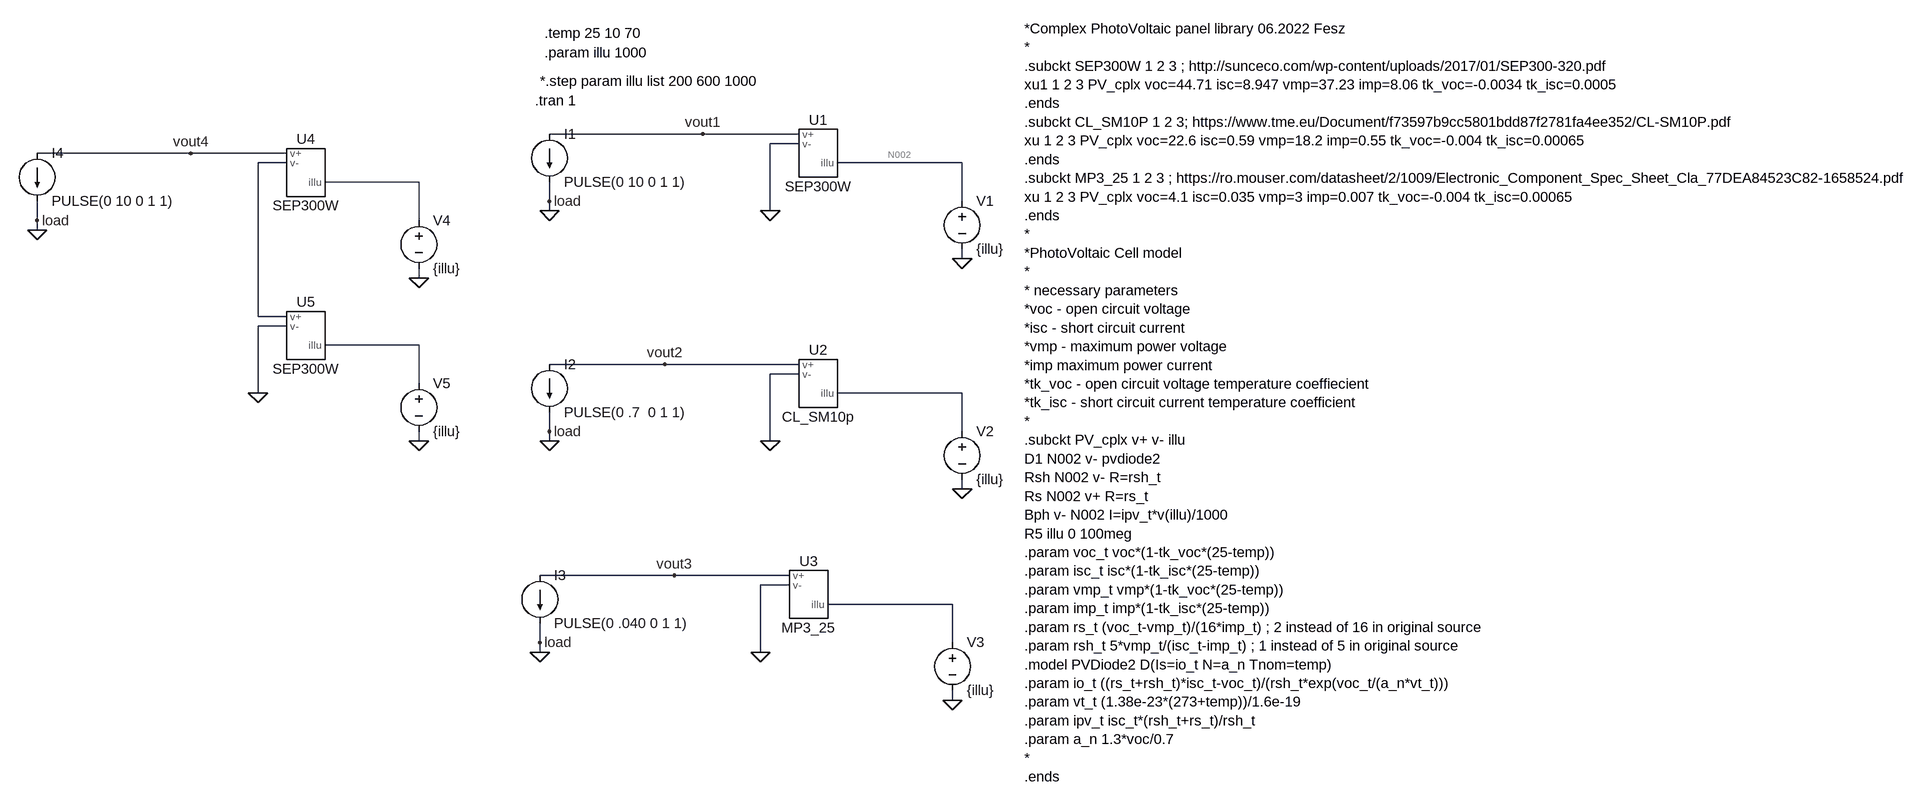
[diagram p0: schematic sch2_with_cells.asc]
sch2_with_cells.asc, the LTspice schematic file:
Version 4
SHEET 1 2124 1312
WIRE -848 256 -1104 256
WIRE -688 256 -848 256
WIRE -688 272 -736 272
WIRE -1872 288 -2128 288
WIRE -1712 288 -1872 288
WIRE -1712 304 -1760 304
WIRE -416 304 -624 304
WIRE -1440 336 -1648 336
WIRE -1104 368 -1104 336
WIRE -416 368 -416 304
WIRE -1104 384 -1104 368
WIRE -736 384 -736 272
WIRE -2128 400 -2128 368
WIRE -1440 400 -1440 336
WIRE -2128 416 -2128 400
WIRE -416 464 -416 448
WIRE -1440 496 -1440 480
WIRE -1760 560 -1760 304
WIRE -1712 560 -1760 560
WIRE -1712 576 -1760 576
WIRE -1440 608 -1648 608
WIRE -912 640 -1104 640
WIRE -688 640 -912 640
WIRE -688 656 -736 656
WIRE -1440 672 -1440 608
WIRE -1760 688 -1760 576
WIRE -416 688 -624 688
WIRE -1104 752 -1104 720
WIRE -416 752 -416 688
WIRE -1440 768 -1440 752
WIRE -1104 768 -1104 752
WIRE -736 768 -736 656
WIRE -416 848 -416 832
WIRE -896 992 -1120 992
WIRE -704 992 -896 992
WIRE -704 1008 -752 1008
WIRE -432 1040 -640 1040
WIRE -1120 1104 -1120 1072
WIRE -432 1104 -432 1040
WIRE -1120 1120 -1120 1104
WIRE -752 1120 -752 1008
WIRE -432 1200 -432 1184
FLAG -1104 384 0
FLAG -736 384 0
FLAG -416 464 0
FLAG -1104 368 load
FLAG -1104 768 0
FLAG -736 768 0
FLAG -416 848 0
FLAG -1104 752 load
FLAG -1120 1120 0
FLAG -752 1120 0
FLAG -432 1200 0
FLAG -1120 1104 load
FLAG -848 256 vout1
FLAG -912 640 vout2
FLAG -896 992 vout3
FLAG -2128 416 0
FLAG -1440 496 0
FLAG -2128 400 load
FLAG -1872 288 vout4
FLAG -1440 768 0
FLAG -1760 688 0
SYMBOL testcell1 -656 288 R0
SYMATTR InstName U1
SYMATTR Value SEP300W
SYMBOL current -1104 256 R0
WINDOW 123 0 0 Left 0
WINDOW 39 0 0 Left 0
SYMATTR InstName I1
SYMATTR Value PULSE(0 10 0 1 1)
SYMBOL voltage -416 352 R0
SYMATTR InstName V1
SYMATTR Value {illu}
SYMBOL testcell1 -656 672 R0
SYMATTR InstName U2
SYMATTR Value CL_SM10p
SYMBOL current -1104 640 R0
WINDOW 123 0 0 Left 0
WINDOW 39 0 0 Left 0
SYMATTR InstName I2
SYMATTR Value PULSE(0 .7  0 1 1)
SYMBOL voltage -416 736 R0
SYMATTR InstName V2
SYMATTR Value {illu}
SYMBOL testcell1 -672 1024 R0
SYMATTR InstName U3
SYMATTR Value MP3_25
SYMBOL current -1120 992 R0
WINDOW 123 0 0 Left 0
WINDOW 39 0 0 Left 0
SYMATTR InstName I3
SYMATTR Value PULSE(0 .040 0 1 1)
SYMBOL voltage -432 1088 R0
SYMATTR InstName V3
SYMATTR Value {illu}
SYMBOL testcell1 -1680 320 R0
SYMATTR InstName U4
SYMATTR Value SEP300W
SYMBOL current -2128 288 R0
WINDOW 123 0 0 Left 0
WINDOW 39 0 0 Left 0
SYMATTR InstName I4
SYMATTR Value PULSE(0 10 0 1 1)
SYMBOL voltage -1440 384 R0
SYMATTR InstName V4
SYMATTR Value {illu}
SYMBOL testcell1 -1680 592 R0
SYMATTR InstName U5
SYMATTR Value SEP300W
SYMBOL voltage -1440 656 R0
SYMATTR InstName V5
SYMATTR Value {illu}
TEXT -312 80 Left 2 !*Complex PhotoVoltaic panel library 06.2022 Fesz\n*\n.subckt SEP300W 1 2 3 ; http://sunceco.com/wp-content/uploads/2017/01/SEP300-320.pdf\nxu1 1 2 3 PV_cplx voc=44.71 isc=8.947 vmp=37.23 imp=8.06 tk_voc=-0.0034 tk_isc=0.0005\n.ends\n.subckt CL_SM10P 1 2 3; https://www.tme.eu/Document/f73597b9cc5801bdd87f2781fa4ee352/CL-SM10P.pdf\nxu 1 2 3 PV_cplx voc=22.6 isc=0.59 vmp=18.2 imp=0.55 tk_voc=-0.004 tk_isc=0.00065\n.ends\n.subckt MP3_25 1 2 3 ; https://ro.mouser.com/datasheet/2/1009/Electronic_Component_Spec_Sheet_Cla_77DEA84523C82-1658524.pdf\nxu 1 2 3 PV_cplx voc=4.1 isc=0.035 vmp=3 imp=0.007 tk_voc=-0.004 tk_isc=0.00065\n.ends\n*\n*PhotoVoltaic Cell model\n*\n* necessary parameters\n*voc - open circuit voltage\n*isc - short circuit current\n*vmp - maximum power voltage\n*imp maximum power current\n*tk_voc - open circuit voltage temperature coeffiecient\n*tk_isc - short circuit current temperature coefficient\n*\n.subckt PV_cplx v+ v- illu \nD1 N002 v- pvdiode2\nRsh N002 v- R=rsh_t\nRs N002 v+ R=rs_t\nBph v- N002 I=ipv_t*v(illu)/1000\nR5 illu 0 100meg\n.param voc_t voc*(1-tk_voc*(25-temp))\n.param isc_t isc*(1-tk_isc*(25-temp))\n.param vmp_t vmp*(1-tk_voc*(25-temp))\n.param imp_t imp*(1-tk_isc*(25-temp))\n.param rs_t (voc_t-vmp_t)/(16*imp_t) ; 2 instead of 16 in original source\n.param rsh_t 5*vmp_t/(isc_t-imp_t) ; 1 instead of 5 in original source\n.model PVDiode2 D(Is=io_t N=a_n Tnom=temp)\n.param io_t ((rs_t+rsh_t)*isc_t-voc_t)/(rsh_t*exp(voc_t/(a_n*vt_t)))\n.param vt_t (1.38e-23*(273+temp))/1.6e-19\n.param ipv_t isc_t*(rsh_t+rs_t)/rsh_t\n.param a_n 1.3*voc/0.7\n*\n.ends
TEXT -1112 88 Left 2 !.temp 25 10 70
TEXT -1112 120 Left 2 !.param illu 1000
TEXT -1120 168 Left 2 !*.step param illu list 200 600 1000
TEXT -1128 200 Left 2 !.tran 1

The netlist it stands for:
* sch2_with_cells.asc
XU1 vout1 0 N002 SEP300W  ; pins v+ v- illu
I1 vout1 0 PULSE(0 10 0 1 1)
V1 N002 0 {illu}
XU2 vout2 0 N005 CL_SM10p  ; pins v+ v- illu
I2 vout2 0 PULSE(0 .7  0 1 1)
V2 N005 0 {illu}
XU3 vout3 0 N006 MP3_25  ; pins v+ v- illu
I3 vout3 0 PULSE(0 .040 0 1 1)
V3 N006 0 {illu}
XU4 vout4 N001 N003 SEP300W  ; pins v+ v- illu
I4 vout4 0 PULSE(0 10 0 1 1)
V4 N003 0 {illu}
XU5 N001 0 N004 SEP300W  ; pins v+ v- illu
V5 N004 0 {illu}
*Complex PhotoVoltaic panel library 06.2022 Fesz
*
.subckt SEP300W 1 2 3 ; http://sunceco.com/wp-content/uploads/2017/01/SEP300-320.pdf
xu1 1 2 3 PV_cplx voc=44.71 isc=8.947 vmp=37.23 imp=8.06 tk_voc=-0.0034 tk_isc=0.0005
.ends
.subckt CL_SM10P 1 2 3; https://www.tme.eu/Document/f73597b9cc5801bdd87f2781fa4ee352/CL-SM10P.pdf
xu 1 2 3 PV_cplx voc=22.6 isc=0.59 vmp=18.2 imp=0.55 tk_voc=-0.004 tk_isc=0.00065
.ends
.subckt MP3_25 1 2 3 ; https://ro.mouser.com/datasheet/2/1009/Electronic_Component_Spec_Sheet_Cla_77DEA84523C82-1658524.pdf
xu 1 2 3 PV_cplx voc=4.1 isc=0.035 vmp=3 imp=0.007 tk_voc=-0.004 tk_isc=0.00065
.ends
*
*PhotoVoltaic Cell model
*
* necessary parameters
*voc - open circuit voltage
*isc - short circuit current
*vmp - maximum power voltage
*imp maximum power current
*tk_voc - open circuit voltage temperature coeffiecient
*tk_isc - short circuit current temperature coefficient
*
.subckt PV_cplx v+ v- illu
D1 N002 v- pvdiode2
Rsh N002 v- R=rsh_t
Rs N002 v+ R=rs_t
Bph v- N002 I=ipv_t*v(illu)/1000
R5 illu 0 100meg
.param voc_t voc*(1-tk_voc*(25-temp))
.param isc_t isc*(1-tk_isc*(25-temp))
.param vmp_t vmp*(1-tk_voc*(25-temp))
.param imp_t imp*(1-tk_isc*(25-temp))
.param rs_t (voc_t-vmp_t)/(16*imp_t) ; 2 instead of 16 in original source
.param rsh_t 5*vmp_t/(isc_t-imp_t) ; 1 instead of 5 in original source
.model PVDiode2 D(Is=io_t N=a_n Tnom=temp)
.param io_t ((rs_t+rsh_t)*isc_t-voc_t)/(rsh_t*exp(voc_t/(a_n*vt_t)))
.param vt_t (1.38e-23*(273+temp))/1.6e-19
.param ipv_t isc_t*(rsh_t+rs_t)/rsh_t
.param a_n 1.3*voc/0.7
*
.ends
.temp 25 10 70
.param illu 1000
*.step param illu list 200 600 1000
.tran 1
.backanno
.end